# Altium schematic sheet RTL8153B-VB-CG1_RTL8153B-VB-CG.schdoc
size 124 x 101 mm
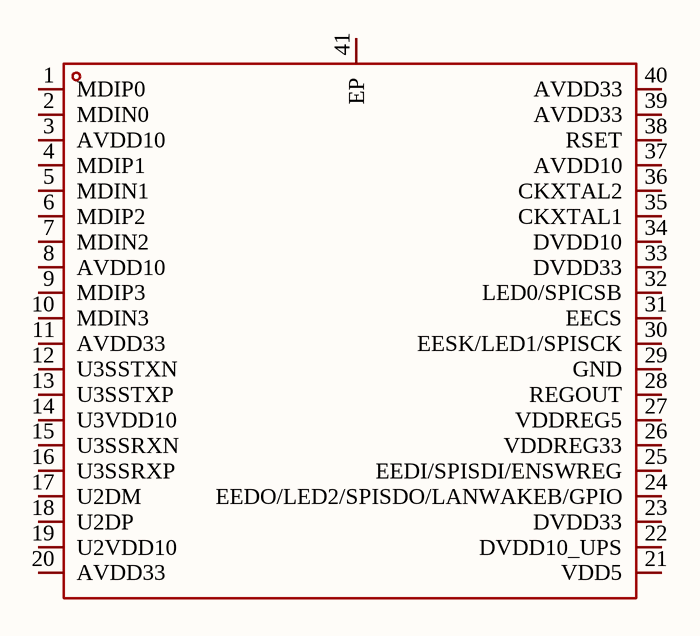
[diagram p0: RTL8153B-VB-CG1_RTL8153B-VB-CG.schdoc]

## Parts
U?  RTL8153B-VB-CG  [QFN-40_L5.0-W5.0-P0.40-BL-EP3.7]  (value not drawn)

## Nets

Not connected (* = marked no-connect by the designer): U? 1(MDIP0) 2(MDIN0) 3(AVDD10) 4(MDIP1) 5(MDIN1) 6(MDIP2) 7(MDIN2) 8(AVDD10) 9(MDIP3) 10(MDIN3) 11(AVDD33) 12(U3SSTXN) 13(U3SSTXP) 14(U3VDD10) 15(U3SSRXN) 16(U3SSRXP) 17(U2DM) 18(U2DP) 19(U2VDD10) 20(AVDD33) 21(VDD5) 22(DVDD10_UPS) 23(DVDD33) 24(EEDO/LED2/SPISDO/LANWAKEB/GPIO) 25(EEDI/SPISDI/ENSWREG) 26(VDDREG33) 27(VDDREG5) 28(REGOUT) 29(GND) 30(EESK/LED1/SPISCK) 31(EECS) 32(LED0/SPICSB) 33(DVDD33) 34(DVDD10) 35(CKXTAL1) 36(CKXTAL2) 37(AVDD10) 38(RSET) 39(AVDD33) 40(AVDD33) 41(EP)

## Library data of the parts
U? = RTL8153B-VB-CG: Manufacturer: REALTEK(瑞昱); Add into BOM: yes; Supply Voltage: 3.3V；1V；5V; Symbol: RTL8153B-VB-CG; Device: RTL8153B-VB-CG; LCSC Part Name: 集成10/100/1000M以太网控制器用于USB 3.0应用; Supplier Part: C2802072; Manufacturer Part: RTL8153B-VB-CG; Supplier Footprint: QFN-40-EP(5x5); JLCPCB Part Class: Extended Part; Datasheet: https://atta.szlcsc.com/upload/public/pdf/source/20220614/B5E31E0CB1F66CB9DAE335D144E02EAB.pdf; Supplier: LCSC; Convert to PCB: yes; Supply Current: -; Operating Temperature: 0℃~+70℃